# Altium project DARKYDEN.PrjPcb (part 3 of 18)
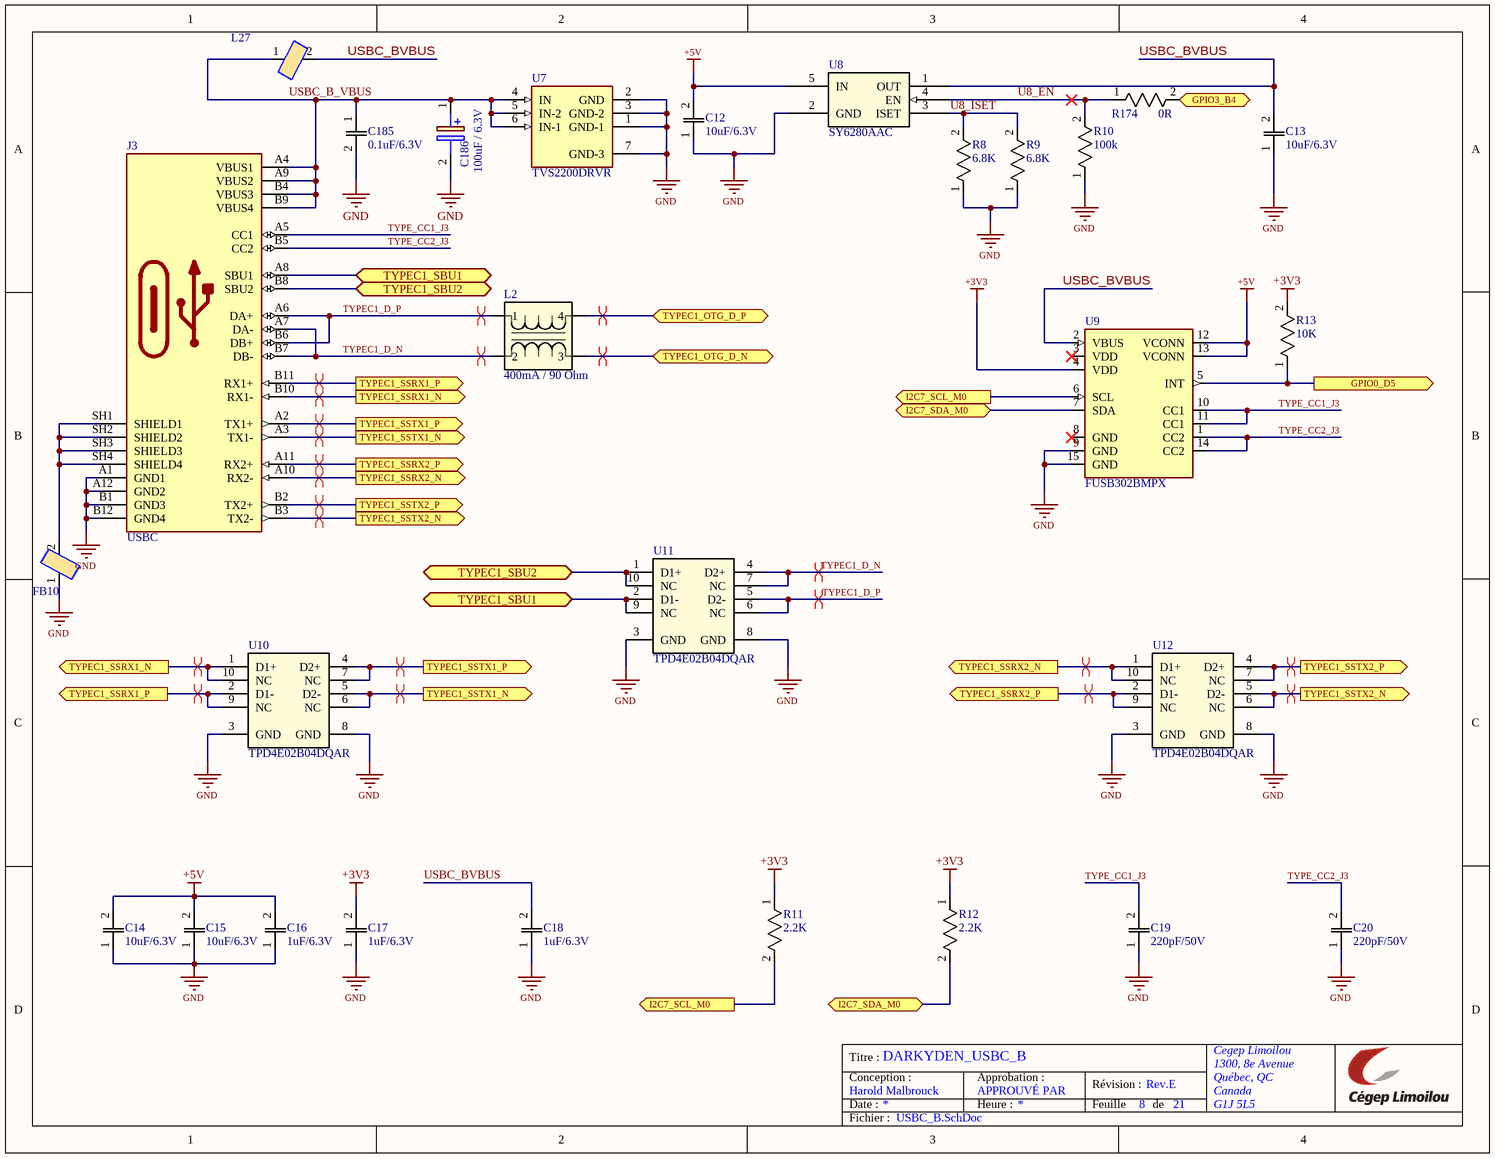
[diagram p109: USBC_B.SchDoc]

## Sheet USBC_B.SchDoc: DARKYDEN_USBC_B (continued)

### Nets
+3V3: C17.2 R11.1 R12.1 R13.2 U9.4(VDD)
+5V: C12.2 C14.2 C15.2 C16.2 U8.5(IN) U9.12(VCONN) U9.13(VCONN)
GND: C12.1 C13.1 C14.1 C15.1 C16.1 C17.1 C18.1 C19.1 C20.1 C185.2 C186.2(-) FB10.1 J3.A1(GND1) J3.A12(GND2) J3.B1(GND3) J3.B12(GND4) R8.1 R9.1 R10.1 U7.1(GND-1) U7.2(GND) U7.3(GND-2) U7.7(GND-3) U8.2(GND) U9.9(GND) U9.15(GND) U10.3(GND) U10.8(GND) U11.3(GND) U11.8(GND) U12.3(GND) U12.8(GND)
GPIO0_D5: R13.1 U9.5(INT) ; port GPIO0_D5
GPIO3_B4: R174.2 ; port GPIO3_B4
I2C7_SCL_M0: R11.2 U9.6(SCL) ; port I2C7_SCL_M0
I2C7_SDA_M0: R12.2 U9.7(SDA) ; port I2C7_SDA_M0
TYPE_CC1_J3: C19.2 J3.A5(CC1) U9.10(CC1) U9.11(CC1)
TYPE_CC2_J3: C20.2 J3.B5(CC2) U9.1(CC2) U9.14(CC2)
TYPEC1_D_N: J3.A7(DA-) J3.B7(DB-) L2.2 U11.4(D2+) U11.7(NC)
TYPEC1_D_P: J3.A6(DA+) J3.B6(DB+) L2.1 U11.5(D2-) U11.6(NC)
TYPEC1_OTG_D_N: L2.3 ; port TYPEC1_OTG_D_N
TYPEC1_OTG_D_P: L2.4 ; port TYPEC1_OTG_D_P
TYPEC1_SBU1: J3.A8(SBU1) U11.2(D1-) U11.9(NC) ; port TYPEC1_SBU1
TYPEC1_SBU2: J3.B8(SBU2) U11.1(D1+) U11.10(NC) ; port TYPEC1_SBU2
TYPEC1_SSRX1_N: J3.B10(RX1-) U10.1(D1+) U10.10(NC) ; port TYPEC1_SSRX1_N
TYPEC1_SSRX1_P: J3.B11(RX1+) U10.2(D1-) U10.9(NC) ; port TYPEC1_SSRX1_P
TYPEC1_SSRX2_N: J3.A10(RX2-) U12.1(D1+) U12.10(NC) ; port TYPEC1_SSRX2_N
TYPEC1_SSRX2_P: J3.A11(RX2+) U12.2(D1-) U12.9(NC) ; port TYPEC1_SSRX2_P
TYPEC1_SSTX1_N: J3.A3(TX1-) U10.5(D2-) U10.6(NC) ; port TYPEC1_SSTX1_N
TYPEC1_SSTX1_P: J3.A2(TX1+) U10.4(D2+) U10.7(NC) ; port TYPEC1_SSTX1_P
TYPEC1_SSTX2_N: J3.B3(TX2-) U12.5(D2-) U12.6(NC) ; port TYPEC1_SSTX2_N
TYPEC1_SSTX2_P: J3.B2(TX2+) U12.4(D2+) U12.7(NC) ; port TYPEC1_SSTX2_P
U8_EN: R10.2 R174.1 U8.4(EN)
U8_ISET: R8.2 R9.2 U8.3(ISET)
USBC_B_VBUS: C185.1 C186.1(+) J3.A4(VBUS1) J3.A9(VBUS2) J3.B4(VBUS3) J3.B9(VBUS4) L27.1 U7.4(IN) U7.5(IN-2) U7.6(IN-1)
USBC_BVBUS: C13.2 C18.2 L27.2 U8.1(OUT) U9.2(VBUS)
NetFB10_2: FB10.2 J3.SH1(SHIELD1) J3.SH2(SHIELD2) J3.SH3(SHIELD3) J3.SH4(SHIELD4)

Not connected (* = marked no-connect by the designer): U9 3(VDD)* 8(GND)*

### Layout directives
differential pair; differential pair class USBC_B: TYPEC1_D_N, TYPEC1_D_P, TYPEC1_OTG_D_N, TYPEC1_OTG_D_P, TYPEC1_SSRX1_N, TYPEC1_SSRX1_P, TYPEC1_SSRX2_N, TYPEC1_SSRX2_P, TYPEC1_SSTX1_N, TYPEC1_SSTX1_P, TYPEC1_SSTX2_N, TYPEC1_SSTX2_P

### Notes on the sheet
- Titre :
- Conception :
- Date :
- Approbation :
- Heure :
- Révision :
- Feuille
- de
- Fichier :